# Altium schematic sheet Main.SchDoc
size A4
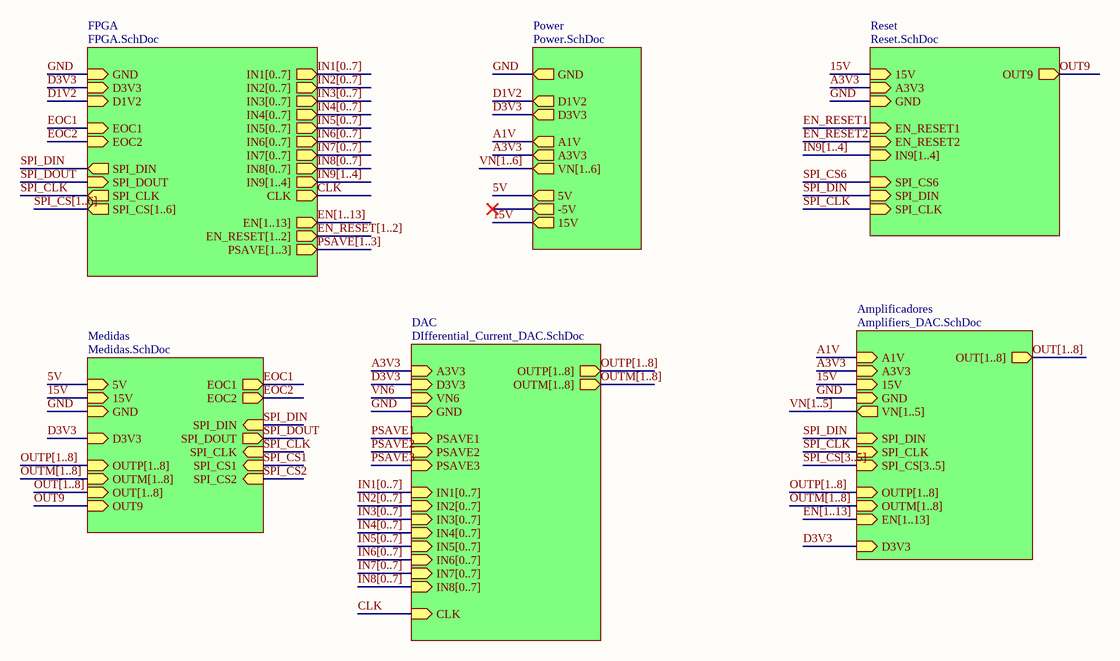
[diagram p0: Main.SchDoc]

## Sub-sheets
Amplificadores = Amplifiers_DAC.SchDoc: OUTP[1..8] (in), OUTM[1..8] (in), EN[1..13] (in), SPI_CS[3..5] (in), SPI_DIN (in), SPI_CLK (in), A3V3 (in), 15V (in), GND (in), OUT[1..8] (out), A1V (in), VN[1..5] (out), D3V3 (in)
DAC = DIfferential_Current_DAC.SchDoc: IN7[0..7] (in), IN8[0..7] (in), IN4[0..7] (in), IN5[0..7] (in), IN6[0..7] (in), IN1[0..7] (in), IN3[0..7] (in), IN2[0..7] (in), PSAVE3 (in), PSAVE2 (in), PSAVE1 (in), D3V3 (in), GND (in), A3V3 (in), OUTP[1..8] (out), OUTM[1..8] (out), VN6 (in), CLK (in)
FPGA = FPGA.SchDoc: GND (in), D3V3 (in), D1V2 (in), IN1[0..7] (out), IN2[0..7] (out), IN3[0..7] (out), IN4[0..7] (out), IN5[0..7] (out), IN6[0..7] (out), IN7[0..7] (out), IN8[0..7] (out), EOC1 (in), EOC2 (in), IN9[1..4] (out), SPI_DIN (out), SPI_DOUT (in), SPI_CLK (out), EN[1..13] (out), EN_RESET[1..2] (out), PSAVE[1..3] (out), SPI_CS[1..6] (out), CLK (out)
Medidas = Medidas.SchDoc: OUTP[1..8] (in), OUTM[1..8] (in), OUT[1..8] (in), EOC1 (out), SPI_DOUT (out), SPI_DIN (in), SPI_CLK (in), SPI_CS1 (in), D3V3 (in), GND (in), 5V (in), 15V (in), EOC2 (out), SPI_CS2 (in), OUT9 (in)
Power = Power.SchDoc: GND (out), 15V (out), A3V3 (out), D3V3 (out), D1V2 (out), A1V (out), 5V (out), -5V (out), VN[1..6] (out)
Reset = Reset.SchDoc: EN_RESET2 (in), GND (in), 15V (in), SPI_CS6 (in), SPI_DIN (in), SPI_CLK (in), A3V3 (in), IN9[1..4] (in), OUT9 (out), EN_RESET1 (in)

## Nets
5V: sheet Medidas/5V, sheet Power/5V
15V: sheet Reset/15V, sheet Medidas/15V, sheet Amplificadores/15V, sheet Power/15V
A1V: sheet Amplificadores/A1V, sheet Power/A1V
A3V3: sheet Reset/A3V3, sheet DAC/A3V3, sheet Amplificadores/A3V3, sheet Power/A3V3
CLK: sheet FPGA/CLK, sheet DAC/CLK
D1V2: sheet FPGA/D1V2, sheet Power/D1V2
D3V3: sheet FPGA/D3V3, sheet Medidas/D3V3, sheet DAC/D3V3, sheet Amplificadores/D3V3, sheet Power/D3V3
EN_RESET1: sheet Reset/EN_RESET1
EN_RESET2: sheet Reset/EN_RESET2
EOC1: sheet FPGA/EOC1, sheet Medidas/EOC1
EOC2: sheet FPGA/EOC2, sheet Medidas/EOC2
GND: sheet FPGA/GND, sheet Reset/GND, sheet Medidas/GND, sheet DAC/GND, sheet Amplificadores/GND, sheet Power/GND
OUT9: sheet Reset/OUT9, sheet Medidas/OUT9
PSAVE1: sheet DAC/PSAVE1
PSAVE2: sheet DAC/PSAVE2
PSAVE3: sheet DAC/PSAVE3
SPI_CLK: sheet FPGA/SPI_CLK, sheet Reset/SPI_CLK, sheet Medidas/SPI_CLK, sheet Amplificadores/SPI_CLK
SPI_CS1: sheet Medidas/SPI_CS1
SPI_CS2: sheet Medidas/SPI_CS2
SPI_CS6: sheet Reset/SPI_CS6
SPI_DIN: sheet FPGA/SPI_DIN, sheet Reset/SPI_DIN, sheet Medidas/SPI_DIN, sheet Amplificadores/SPI_DIN
SPI_DOUT: sheet FPGA/SPI_DOUT, sheet Medidas/SPI_DOUT
VN6: sheet DAC/VN6

## Buses and harness runs
bus EN[1..13] = sheet Amplificadores/EN[1..13]
bus EN[1..13] = sheet FPGA/EN[1..13]
bus EN_RESET[1..2] = sheet FPGA/EN_RESET[1..2]
bus IN1[0..7] = sheet DAC/IN1[0..7]
bus IN1[0..7] = sheet FPGA/IN1[0..7]
bus IN2[0..7] = sheet DAC/IN2[0..7]
bus IN2[0..7] = sheet FPGA/IN2[0..7]
bus IN3[0..7] = sheet DAC/IN3[0..7]
bus IN3[0..7] = sheet FPGA/IN3[0..7]
bus IN4[0..7] = sheet DAC/IN4[0..7]
bus IN4[0..7] = sheet FPGA/IN4[0..7]
bus IN5[0..7] = sheet DAC/IN5[0..7]
bus IN5[0..7] = sheet FPGA/IN5[0..7]
bus IN6[0..7] = sheet DAC/IN6[0..7]
bus IN6[0..7] = sheet FPGA/IN6[0..7]
bus IN7[0..7] = sheet DAC/IN7[0..7]
bus IN7[0..7] = sheet FPGA/IN7[0..7]
bus IN8[0..7] = sheet DAC/IN8[0..7]
bus IN8[0..7] = sheet FPGA/IN8[0..7]
bus IN9[1..4] = sheet FPGA/IN9[1..4]
bus IN9[1..4] = sheet Reset/IN9[1..4]
bus OUT[1..8] = sheet Amplificadores/OUT[1..8]
bus OUT[1..8] = sheet Medidas/OUT[1..8]
bus OUTM[1..8] = sheet Amplificadores/OUTM[1..8]
bus OUTM[1..8] = sheet DAC/OUTM[1..8]
bus OUTM[1..8] = sheet Medidas/OUTM[1..8]
bus OUTP[1..8] = sheet Amplificadores/OUTP[1..8]
bus OUTP[1..8] = sheet DAC/OUTP[1..8]
bus OUTP[1..8] = sheet Medidas/OUTP[1..8]
bus PSAVE[1..3] = sheet FPGA/PSAVE[1..3]
bus SPI_CS[1..6] = sheet FPGA/SPI_CS[1..6]
bus SPI_CS[3..5] = sheet Amplificadores/SPI_CS[3..5]
bus VN[1..5] = sheet Amplificadores/VN[1..5]
bus VN[1..6] = sheet Power/VN[1..6]